# Altium project PCB_Project.PrjPcb
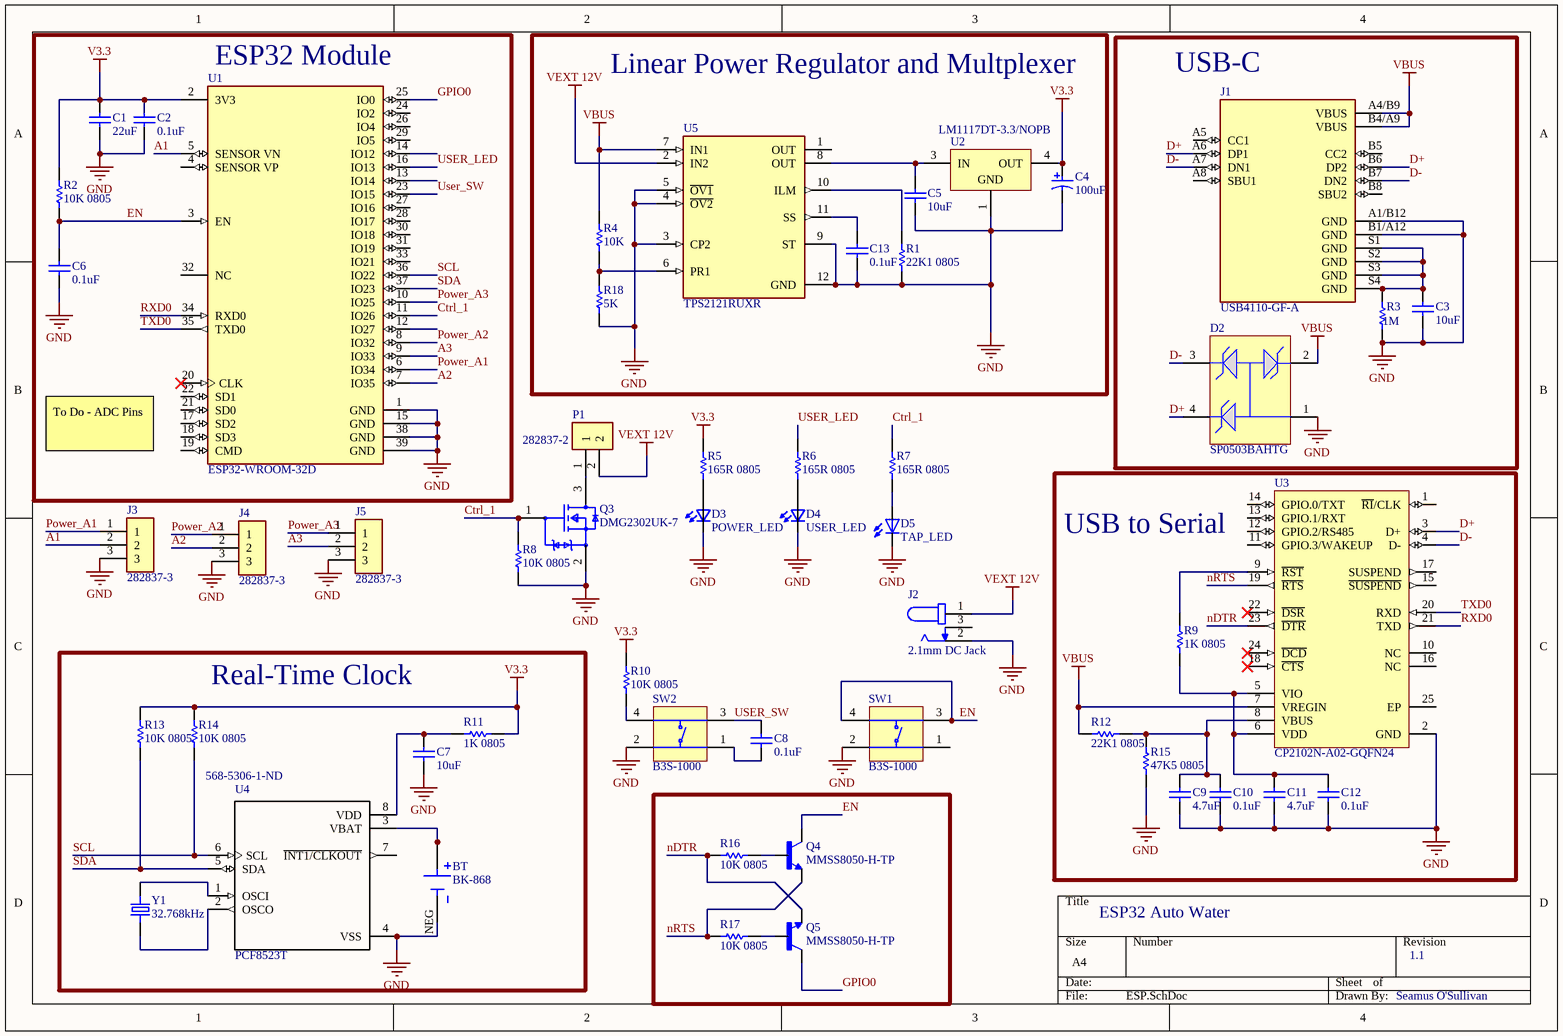
[diagram p0: ESP.SchDoc]
1 sheet, 53 parts. Net scope: global (net labels, ports and power ports of the same name join across sheets).
Board file: PCB.PcbDoc

## Sheet ESP.SchDoc: ESP32 Auto Water
size A4; DrawnBy: Seamus O'Sullivan; Revision: 1.1

### Parts
BT  BK-868  [BAT_BK-868]
C1  22uF  [CAPC1206(3216)190_N]
C2  0.1uF  [CAPC2013X135X45ML10T25]
C3  10uF  [CAPC2013X135X45ML10T25]
C4  100uF  [AVX-TAJD107K016RNJ-2_M]
C5  10uF  [CAPC2013X135X45ML10T25]
C6  0.1uF  [CAPC2013X135X45ML10T25]
C7  10uF  [CAPC2013X135X45ML10T25]
C8  0.1uF  [CAPC2013X135X45ML10T25]
C9  4.7uF  [CAPC2013X145X50ML20T25]
C10  0.1uF  [CAPC2013X135X45ML10T25]
C11  4.7uF  [CAPC2013X145X50ML20T25]
C12  0.1uF  [CAPC2013X135X45ML10T25]
C13  0.1uF  [CAPC2013X135X45ML10T25]
D2  SP0503BAHTG  [LFUS-SOT143-4_V]
D3  POWER_LED  [0603]
D4  USER_LED  [0603]
D5  TAP_LED  [DIOC200X125X110]
J1  USB4110-GF-A  [GCT_USB4110-GF-A]
J2  2.1mm DC Jack  [CUI_PJ-036AH-SMT-TR]
J3  282837-3  [TE_282837-3]
J4  282837-3  [TE_282837-3]
J5  282837-3  [TE_282837-3]
P1  282837-2  [TE_282837-2]
Q3  DMG2302UK-7  [FP-SOT23-MFG]
Q4  MMSS8050-H-TP  [TRANS_MMSS8050-H-TP]
Q5  MMSS8050-H-TP  [TRANS_MMSS8050-H-TP]
R1  22K1 0805  [RESC2013X50X30ML20T20]
R2  10K 0805  [RESC2013X50X30NL20T20]
R3  1M  [RESC0805(2012)_N]
R4  10K  [RESC2013X50X30NL20T20]
R5  165R 0805  [RESC2013X50X30ML20T20]
R6  165R 0805  [RESC2013X50X30ML20T20]
R7  165R 0805  [RESC2013X50X30ML20T20]
R8  10K 0805  [RESC2013X50X30NL20T20]
R9  1K 0805  [RESC2013X50X30ML20T20]
R10  10K 0805  [RESC2013X50X30NL20T20]
R11  1K 0805  [RESC2013X50X30ML20T20]
R12  22K1 0805  [RESC2013X50X30ML20T20]
R13  10K 0805  [RESC2013X50X30NL20T20]
R14  10K 0805  [RESC2013X50X30NL20T20]
R15  47K5 0805  [RESC2013X50X30LL20T20]
R16  10K 0805  [RESC2013X50X30NL20T20]
R17  10K 0805  [RESC2013X50X30NL20T20]
R18  5K  [RESC2013X50X30ML20T20]
SW1  B3S-1000  [OMRON-B3S-1000-4_V]
SW2  B3S-1000  [OMRON-B3S-1000-4_V]
U1  ESP32-WROOM-32D  [FP-ESP32-WROOM-32D-MFG]
U2  LM1117DT-3.3/NOPB  [NDP0003B_M]
U3  CP2102N-A02-GQFN24  [SLAB-QFN-24-2550x2550TP_A_V]
U4  PCF8523T  Supplier Part Number 1: 568-5306-1-ND  [*SOIC127P600X175-8N]
U5  TPS2121RUXR  [FP-RUX0012A-MFG]
Y1  32.768kHz  [XTAL_ECS-.327-12.5-34B-TR]

### Blocks framed on the sheet
ESP32 Module: C1 C2 C6 R2 U1
Linear Power Regulator and Multplexer: C4 C5 C13 R1 R4 R18 U2 U5
USB-C: C3 D2 J1 R3
USB to Serial: C9-C12 R9 R12 R15 U3
Real-Time Clock: BT C7 R11 R13 R14 U4 Y1

### Nets
GND: BT.NEG C1.1 C2.1 C3.1 C4.2 C5.1 C6.1 C7.1 C9.1 C10.1 C11.1 C12.1 C13.1 D2.1 D3.1(K2) D4.1(K2) D5.NEG J1.A1/B12(GND) J1.B1/A12(GND) J2.2 J3.3 J4.3 J5.3 Q3.2(S) R1.1 R3.1 R8.1 R15.1 R18.1 SW1.2 SW2.2 U1.1(GND) U1.15(GND) U1.38(GND) U1.39(GND) U2.1(GND) U3.2(GND) U4.4(VSS) U5.3(CP2) U5.4(~{OV2}) U5.5(~{OV1}) U5.9(ST) U5.12(GND)
V3.3: C1.2 C2.2 C4.1 R2.2 R5.2 R10.2 R11.1 R13.2 R14.2 U1.2(3V3) U2.4(OUT)
VBUS: D2.2 J1.A4/B9(VBUS) J1.B4/A9(VBUS) R4.2 R12.1 U3.7(VREGIN) U5.7(IN1)
VEXT 12V: J2.1 P1.2 U5.2(IN2)
A1: J3.2 U1.5(SENSOR_VN)
A2: J4.2 U1.7(IO35)
A3: J5.2 U1.9(IO33)
Ctrl_1: Q3.1(G) R7.2 R8.2 U1.11(IO26)
D+: D2.4 J1.A6(DP1) J1.B6(DP2) U3.3(D+)
D-: D2.3 J1.A7(DN1) J1.B7(DN2) U3.4(D-)
EN: C6.2 Q4.3(C) R2.1 SW1.3 SW1.4 U1.3(EN)
GPIO0: Q5.3(C) U1.25(IO0)
nDTR: Q5.2(E) R16.2 U3.23(~{DTR})
nRTS: Q4.2(E) R17.2 U3.19(~{RTS})
Power_A1: J3.1 U1.6(IO34)
Power_A2: J4.1 U1.8(IO32)
Power_A3: J5.1 U1.10(IO25)
RXD0: U1.34(RXD0) U3.21(TXD)
SCL: R14.1 U1.36(IO22) U4.6(SCL)
SDA: R13.1 U1.37(IO23) U4.5(SDA)
TXD0: U1.35(TXD0) U3.20(RXD)
USER_LED: R6.2 U1.16(IO13)
USER_SW: C8.2 SW2.3 U1.23(IO15)
NetBT_S1+: BT.S1+(POS) BT.S2+(POS) U4.3(VBAT)
NetC3_2: C3.2 J1.S1(GND) J1.S2(GND) J1.S3(GND) J1.S4(GND) R3.2
NetC5_2: C5.2 U2.3(IN) U5.8(OUT)
NetC7_2: C7.2 R11.2 U4.8(VDD)
NetC8_1: C8.1 SW2.1
NetC9_2: C9.2 C10.2 R12.2 R15.2 U3.8(VBUS)
NetC11_2: C11.2 C12.2 R9.1 U3.5(VIO) U3.6(VDD)
NetC13_2: C13.2 U5.11(SS)
NetD3_2: D3.2(A2) R5.1
NetD4_2: D4.2(A2) R6.1
NetD5_POS: D5.POS R7.1
NetP1_1: P1.1 Q3.3(D)
NetQ4_1: Q4.1(B) R16.1
NetQ5_1: Q5.1(B) R17.1
NetR1_2: R1.2 U5.10(ILM)
NetR4_1: R4.1 R18.2 U5.6(PR1)
NetR9_2: R9.2 U3.9(~{RST})
NetR10_1: R10.1 SW2.4
NetU4_1: U4.1(OSCI) Y1.2
NetU4_2: U4.2(OSCO) Y1.1

Not connected (* = marked no-connect by the designer): J1 A5(CC1) A8(SBU1) B5(CC2) B8(SBU2); J2 3; SW1 1; U1 4(SENSOR_VP) 12(IO27) 13(IO14) 14(IO12) 17(SD2) 18(SD3) 19(CMD) 20(CLK)* 21(SD0) 22(SD1) 24(IO2) 26(IO4) 27(IO16) 28(IO17) 29(IO5) 30(IO18) 31(IO19) 32(NC) 33(IO21); U3 1(~{RI}/CLK) 10(NC) 11(GPIO.3/WAKEUP) 12(GPIO.2/RS485) 13(GPIO.1/RXT) 14(GPIO.0/TXT) 15(~{SUSPEND}) 16(NC) 17(SUSPEND) 18(~{CTS})* 22(~{DSR})* 24(~{DCD})* 25(EP); U4 7(~{INT1/CLKOUT}); U5 1(OUT)

### Notes on the sheet
- To Do - ADC Pins
- Title
- Size:
- Date:
- A4
- Number:
- Time:
- Revision:
- Sheet
- of
- File:

### Library data of the parts
BT = BK-868: BATTERY RETAINER COIN 16MM SMD; MF: MPD; SnapEDA_Link: https://www.snapeda.com/parts/BK-868/Memory%20Protection%20Devices/view-part/4219637/?ref=snap; Value: *; Price: None; Availability: Unavailable; MP: BK-868; DigiKey-Purchase-URL: https://snapeda.com/shop?store=DigiKey&id=4219637; Package: None
C1 = CMP-1037-04992-1: CAP 22uF 16V ±10% 1206 (3216 Metric) Thickness 1.9mm SMD; Case-EIA: 1206; Case-Metric: 3216; Tolerance: Â±10%; Rated Voltage: 16 V; Technology: SMT; Value: 22uF; Max Thickness: 1.9 mm
C2 C6 C8 C10 C12 C13 = CMP-2100-03644-1: Chip Capacitor, 0.1 uF, +/- 10%, 50 V, -55 to 125 degC, 0805 (2012 Metric), RoHS, Tape and Reel; Manufacturer: Murata; Voltage: 50V; Capacitance: 100nF; Insulation Resistance: 10GR; Dielectric Material: Ceramic; Dielectric: X7R; Package Description: 2-Pin Surface Mount Device, Body 2 x 1.25 mm; Manufacturer URL: http://www.murata.com/; Case Code (Imperial): 0805; Datasheet URL: http://psearch.en.murata.com/capacitor/product/GRM21BR71H104KA01%23.pdf; Termination: SMD/SMT; Lead Free: LeadFree; Package Quantity: 1; Mount: SurfaceMount; REACH SVHC: Unknown; Thickness: 0.053inch; Height: 1.25mm; Case/Package: 0805; Voltage Rating: 50V; Width: 0.049inch; Case Code (Metric): 2012; Material: Ceramic; Min Operating Temperature: -55degC; RoHSCompliant: true; Datasheet Version: 42675.0; Voltage Rating (DC): 50V; Tolerance: 10%; Package Reference: 0805; Depth: 1.25mm; Length: 2mm; Max Operating Temperature: 125degC; Packaging: TapeandReel; Number of Pins: 2; Radiation Hardening: No
C3 C5 C7 = CMP-2007-03541-1: Part Number: GRM21BR61E106KA73L; Manufacturer: Murata
C4 = CMP-2000-05064-1: Cap Tant Solid, 100 uF, +/- 10%, 16 V, -55 to 125 degC, 2-Pin SMD (2917), RoHS, Tape and Reel; Manufacturer: AVX; Product Diameter (mm): NotRequiredmm; Case Style: Molded; Product Length (mm): 7.3mm; DCL: 16uA; Capacitance: 100000000pF; Polarity: Polar; Rad Hardened: No; Insulation: NotRequired; ESR: 0.6ohm; DF: 6%; Product Height (mm): 2.9mm; Product Depth (mm): 4.3mm; Voltage: 16VDC; Case Code: D; Operating Temp Range: -55Cto125C; Packaging: TapeandReel; Length W/Weld (max): NotRequiredmm; Datasheet URL: https://datasheet.ciiva.com/26341/559463-da-01-en-tacc-d-7-3-mm-x-4-3-mm-x-2-9-mm-100-uf-26341798.pdf; Length W/Weld: NotRequiredmm; Construction: SMTChip; Wire Form: NotRequired; Tolerance (+ or -): 10%; Manufacturer URL: http://www.avx.com/; Seated Plane Height: NotRequiredmm; Datasheet Version: Apr-13; Lead Spacing (nom): NotRequiredmm; Failure Rate: NotRequired; Seal: NotRequired; Mounting Style: SurfaceMount; Package / Case: 7343-31
C9 C11 = CMP-2007-01010-1: 0805 Tant; Manufacturer: Kemet; Part Number: C0805C475K3PACTU
  C9: ComponentLink1Description: New link; ComponentLink1URL: *
D2 = CMP-2000-05191-1: TVS Diode Array, 30 pF, 30 KV, -40 to 85 degC, 4-Pin SOT143, RoHS, Tape and Reel; Manufacturer: Littelfuse; Direction Type: Uni-Directional; Product Height (mm): 1.05mm; Leakage Current (Max): 0.1uA; Clamping Voltage (Max): 8V; Reverse Stand-off Voltage: 5.5(Min)V; Configuration: Triple; Working Voltage: 5.5V; Product Length (mm): 3.04mm; Working Voltage (Max): 5.5V(Min); Capacitance Value: 30pF; Rad Hardened: No; Number of Elements: 3; Product Depth (mm): 1.4mm; Operating Temperature Max Deg. C: 85C; Suppressor Type: TVS; Operating Temperature Min Deg. C: -40C; Operating Temp Range: -40Cto85C; Mounting: SurfaceMount; Package / Case: SOT-143; Datasheet Version: Dec-13; Package Type: SOT-143; Packaging: TapeandReel; Pin Count: 3+Tab; Operating Temperature Classification: Industrial; Datasheet URL: https://datasheet.ciiva.com/15143/getdatasheetpartid-116020-15143550.pdf; Manufacturer URL: http://www.littelfuse.com/; Leakage Current: 0.1uA; Mounting Style: SurfaceMount; Clamping Voltage: 8V; Polarity: Uni-Directional
D3 = LTST-C191KSKT: Yellow 591nm LED Indication - Discrete 2.1V 0603 _1608 Metric_; MF: Lite-On Inc.; Digi-Key_Part_Number: 160-1448-1-ND; Package: 0603 Lite-On; SnapEDA_Link: https://www.snapeda.com/parts/LTST-C191KSKT/Lite-On%20Inc./view-part/265076/?ref=snap; MP: LTST-C191KSKT; Digi-Key_Purchase_URL: https://www.digikey.com/product-detail/en/lite-on-inc/LTST-C191KSKT/160-1448-1-ND/386838?utm_source=snapeda&utm_medium=aggregator&utm_campaign=symbol; Value: *
D4 = LTST-C191KRKT: Red 631nm LED Indication - Discrete 2V 0603 _1608 Metric_; MF: Lite-On Inc.; Value: *; Package: 0603 Lite-On; Digi-Key_Purchase_URL: https://www.digikey.in/product-detail/en/lite-on-inc/LTST-C191KRKT/160-1447-1-ND/386836?utm_source=snapeda&utm_medium=aggregator&utm_campaign=symbol; SnapEDA_Link: https://www.snapeda.com/parts/LTST-C191KRKT/Lite-On%20Inc./view-part/234319/?ref=snap; Digi-Key_Part_Number: 160-1447-1-ND; MP: LTST-C191KRKT
D5 = LTST-C171TBKT: Blue 470nm LED Indication - Discrete 3.3V 0805 _2012 Metric_; MF: Lite-On Inc.; SnapEDA_Link: https://www.snapeda.com/parts/LTST-C171TBKT/Lite-On%20Inc./view-part/400349/?ref=snap; Availability: Unavailable; Price: None; Package: 0805 Lite-On; Value: *; MP: LTST-C171TBKT
J1 = USB4110-GF-A: USB-C _USB TYPE-C_ USB 2.0 Receptacle Connector 24 _16+8 Dummy_ Position Surface Mount, Right Angle; Through Hole; MF: GCT; Digi-Key_Purchase_URL: https://www.digikey.com/product-detail/en/gct/USB4110-GF-A/2073-USB4110-GF-A-1-ND/10384548?utm_source=snapeda&utm_medium=aggregator&utm_campaign=symbol; Value: *; Package: None; MP: USB4110-GF-A; SnapEDA_Link: https://www.snapeda.com/parts/USB4110-GF-A/Global%20Connector%20Technology/view-part/4001167/?ref=snap; Digi-Key_Part_Number: 2073-USB4110-GF-A-1-ND
J2 = PJ-036AH-SMT-TR: 2.0 x 6.3 mm, 5.0 A, Horizontal, Surface Mount _SMT_, Dc Power Jack Connector; MF: CUI Devices; Value: *; SnapEDA_Link: https://www.snapeda.com/parts/PJ-036AH-SMT-TR/CUI%20Devices/view-part/517505/?ref=snap; Package: None; CUI_purchase_URL: https://www.cuidevices.com/product/interconnect/connectors/dc-power-connectors/jacks/pj-036ah-smt-tr?utm_source=snapeda.com&utm_medium=referral&utm_campaign=snapedaBOM; MP: PJ-036AH-SMT-TR; Price: None; Availability: Unavailable
J3-J5 = 282837-3: Wire to Board 3 Position 5.08 mm Pitch 30-16 AWG Euro Style Terminal Block; MF: TE Connectivity; Package: None; Digi-Key_Part_Number: A113321-ND; MP: 282837-3; TE_purchase_URL: https://www.te.com/usa-en/product-282837-3.html?te_bu=Cor&te_type=disp&te_campaign=seda_glo_cor-seda-global-disp-prtnr-fy19-seda-model-bom-cta_sma-317_1&elqCampaignId=32493; SnapEDA_Link: https://www.snapeda.com/parts/282837-3/TE%20Connectivity%20AMP%20Connectors/view-part/2765182/?ref=snap; Digi-Key_Purchase_URL: https://www.digikey.in/product-detail/en/te-connectivity-amp-connectors/282837-3/A113321-ND/2187974?utm_source=snapeda&utm_medium=aggregator&utm_campaign=symbol; Value: *; Supplier 1: Digi-Key; Supplier Part Number 1: A113321-ND
P1 = 282837-2: Connector Terminal Blocks Receptacle 2 Position 5.08mm Solder Straight Thru-Hole 13.5A/Contact; MF: TE Connectivity; Digi-Key_Purchase_URL: https://www.digikey.in/product-detail/en/te-connectivity-amp-connectors/282837-2/A113320-ND/2187973?utm_source=snapeda&utm_medium=aggregator&utm_campaign=symbol; Value: *; TE_purchase_URL: https://www.te.com/usa-en/product-282837-2.html?te_bu=Cor&te_type=disp&te_campaign=seda_glo_cor-seda-global-disp-prtnr-fy19-seda-model-bom-cta_sma-317_1&elqCampaignId=32493; Package: None; MP: 282837-2; SnapEDA_Link: https://www.snapeda.com/parts/282837-2/TE%20Connectivity%20AMP%20Connectors/view-part/2549980/?ref=snap; Digi-Key_Part_Number: A113320-ND; Supplier 1: Digi-Key; Supplier Part Number 1: A113320-ND
Q3 = CMP-12801-000001-1: MOSFET N-CH 20V 2.8A SOT23; Manufacturer: Diodes Inc.; Reverse Recovery Time: 5.3ns; Gate Charge At Vgs: 2.8nC @ 10V; Turn On Delay Time: 0.6ns; Pulse Drain Current: 12A; Max Forward Diode Voltage: 1.2V; Reverse Recovery Charge: 0.5nC; Automotive Grade: Grade 0; Threshold Vgs Min: 0.3V; Number Of N Channels: 1; Standoff Height: 0.013mm; Typ Forward Diode Voltage: 0.7V; Drain To Source Resistance: 61mΩ; Rthja Max: 192°C/W; Max Junction Temp: +150°C; Input Capacitace At Vds: 130pF @ 10V; Threshold Vgs Max: 1V; Turn Off Delay Time: 4.2ns; Depletion Mode: False; Gate To Source Voltage: 12V; Power Dissipation: 0.66W; Device Class L1: Discrete Semiconductors; Footprint Url: https://www.diodes.com/assets/Package-Files/SOT23.pdf; Lead Free: Yes; Manufacturer Part Number: DMG2302UK-7; Temperature Range High: +150°C; Drain To Source Voltage: 20V; Category: Trans; Digikey Description: MOSFET N-CH 20V 2.8A SOT23; RoHS: TRUE; Device Class L2: Transistors; Height: 1.1mm; Automotive: Yes; Package: SOT23; Drain To Source Breakdown Voltage: 20V; Continuous Drain Current: 2.8A; ComponentLink2Description: Datasheet; Device Class L3: MOSFETs; Octopart: https://octopart.com/dmg2302uk-7-diodes+inc.-73850182; Temperature Range Low: -55°C; Temperature: -55°C to +150°C; Number Of Channels: 1; ComponentLink2URL: https://www.diodes.com/assets/Datasheets/DMG2302UK.pdf
Q4 Q5 = MMSS8050-H-TP: Bipolar _BJT_ Transistor NPN 25V 1.5A 100MHz 625mW Surface Mount SOT-23; MF: Micro Commercial; Value: *; Availability: Unavailable; SnapEDA_Link: https://www.snapeda.com/parts/MMSS8050-H-TP/Micro%20Commercial/view-part/423878/?ref=snap; Package: SOT-23 Micro Commercial; MP: MMSS8050-H-TP; Price: None
R1 R12 = CMP-2001-03689-1: Manufacturer: Vishay Dale; Part Number: CRCW080522K1FKEA
R2 R4 R8 R10 R13 R14 R16 R17 = CMP-2001-04909-1: Manufacturer: Vishay Dale; Part Number: CRCW080510K0FKEB
R3 = CMP-1013-00849-1: 1M 0.125W 1% 0805 (2012 Metric)  SMD; Value: 1000000.00 Ohm; Case-Metric: 2012; Case-EIA: 0805; Technology: SMT; Power: 0.125 W; Tolerance: 1 %
R5-R7 = CMP-2001-04978-1: Part Number: CRCW0805165RFKEA; Manufacturer: Vishay Dale
R9 R11 = CMP-2001-03596-1: Part Number: CRCW08051K00FKEB; Manufacturer: Vishay Dale
R15 = CMP-2001-03941-1: Part Number: CRCW080547K5FKEA; Manufacturer: Vishay Dale
R18 = CMP-2001-04239-1: Part Number: CRCW08055K00FKTA; Manufacturer: Vishay Dale
SW1 SW2 = CMP-1677-00001-4: Sealed Tactile Switch, SPST-NO, 3 to 24 V, -25 to 70 degC, 4-Pin SMD, RoHS, Bulk; Manufacturer: Omron; Voltage Rating: 24 V; Current Rating: 50 mA; Contact Plating: Silver; ComponentLink1Description: Manufacturer URL; Packaging: Bulk; Package Quantity: 1500; Min Operating Temperature: -25 degC; Max Operating Temperature: 70 degC; REACH SVHC: No SVHC; ComponentLink1URL: http://www.omron.com/; RoHSCompliant: true; PackageDescription: 4-Pin Surface Mount Device, Body 6.6 x 6 mm; ComponentLink2URL: http://www.omron.com/ecb/products/pdf/en-b3s.pdf; DatasheetVersion: 10/2014; Length: 6.6 mm; Height: 4.3 mm; ComponentLink2Description: Datasheet; Mount: Surface Mount; Mounting Technology: Surface Mount; PackageReference: B3S-1000
U1 = CMP-194065-000003-1: WIFI MODULE 32MBITS SPI FLASH; Manufacturer: Espressif Systems; Max Supply Voltage: 3.6V; Nominal Supply Current: 500mA; Max Frequency: 2484MHz; Number Of Adc Channels: 16; Number Of Gpio: 32; Interface: I2C,SPI,UART,Ethernet,I2S,Other; Data Rate: 150Mbits/s; Min Supply Voltage: 3V; Bandwidth: 72MHz; Sensitivity: -98dBm; Octopart: https://octopart.com/esp32-wroom-32d-espressif+systems-91040050; Package: ESP32-WROOM-32D; ComponentLink2URL: https://www.espressif.com/sites/default/files/documentation/esp32-wroom-32d_esp32-wroom-32u_datasheet_en.pdf; Lead Free: Yes; Category: UNK; Mouser Description: Wi-Fi/BT BLE Module ESP32-D0WD, SPI Flash, UART, P; Device Class L1: Integrated Circuits (ICs); RoHS: TRUE; Temperature Range Low: -40°C; ComponentLink2Description: Datasheet; Digikey Description: WIFI MODULE 32MBITS SPI FLASH; Height: 3.2mm; Temperature: -40°C to +85°C; Manufacturer Part Number: ESP32-WROOM-32D; Device Class L3: Transceivers; Device Class L2: RF Semiconductors and Devices; Temperature Range High: +85°C; Automotive: No
U2 = CMP-0062-00703-3: 800mA Low-Dropout Linear Regulator, 3-pin TO-252, Pb-Free; Manufacturer: Texas Instruments; PowerWise: N; PackageTopMarking: NSUZXYTT*LM1117*DT-3.3; CompType: LDO IC; RoHS: Y; PackageReference: NDP0003B; PackageDescription: TO252, Molded, Jedec, 6.8 x 6.10 x 2.30mm Body, 3 Lead, 2.28mm Pitch, Surface Mount; Code_JEDEC: TO-252-AA; PinCount: 3; ComponentLink1URL: http://www.ti.com/general/docs/lit/getliterature.tsp?genericPartNumber=LM1117-N&fileType=pdf; ComponentLink1Description: Datasheet URL; Parameter 1: *
U3 = CMP-2000-07570-1: USBXpress(TM) Family, 4 GPIOs, 2.2 to 3.6 V, -40 to 85 degC, 24-Pin QFN, RoHS; Manufacturer: Silicon Labs; Max Supply Voltage: 3.6V; Min Supply Voltage: 3V; Datasheet Version: Rev. 1.1, 08/2016; Max Operating Temperature: 85degC; Case\/Package: QFN; Number of Pins: 24; Min Operating Temperature: -40degC; Mounting Technology: SurfaceMount; Manufacturer URL: http://www.silabs.com/; RoHSCompliant: False; Package Reference: QFN-24-2550x2550TP_A; Datasheet URL: http://www.silabs.com/documents/public/data-sheets/cp2102n-datasheet.pdf; Package Description: 24-Pin Quad Flat No-lead Package, Body 4 x 4 mm, Pitch 0.5 mm; REACH SVHC: Unknown
U4 = PCF8523T: Real Time Clock _RTC_ IC Clock/Calendar IÂ²C, 2-Wire Serial 8-SOIC _0.154, 3.90mm Width_; MF: NXP USA; Digi-Key_Purchase_URL: https://www.digikey.com/product-detail/en/nxp-usa-inc/PCF8523T-1,118/568-5306-1-ND/2530784?utm_source=snapeda&utm_medium=aggregator&utm_campaign=symbol; MP: PCF8523T; Package: VDFN-8 NXP USA; SnapEDA_Link: https://www.snapeda.com/parts/PCF8523T/NXP%20USA%20Inc./view-part/3227764/?ref=snap; Digi-Key_Part_Number: 568-5306-1-ND; Value: *; Supplier 1: Digi-Key
U5 = CMP-04910-000009-1: PWR MGMT BATTERY MGMT; Manufacturer: Texas Instruments; Min Supply Voltage: 2.8V; Max Junction Temp: +125°C; Output Voltage: 22V; Output Current: 1.5-5.2A; Standoff Height: 0mm; Number Of Outputs: 1; Nominal Supply Current: 300uA; Device Class L2: Power Management ICs; Octopart: https://octopart.com/tps2121ruxr-texas+instruments-95511053; Mouser Description: 2.7-22V, 56m?, 4.5A, Priority Power MUX with Seamless Switchover 12-VQFN-HR -40 to 125; Lead Free: Yes; Digikey Description: PWR MGMT BATTERY MGMT; Manufacturer Part Number: TPS2121RUXR; Height: 1mm; Device Class L1: Integrated Circuits (ICs); Category: IC; Max Supply Voltage: 22V; ComponentLink2Description: Datasheet; Temperature: -40°C to +125°C; Temperature Range High: +125°C; ComponentLink2URL: https://www.ti.com/lit/ds/symlink/tps2121.pdf; Automotive: No; Package: RUX0012A; RoHS: TRUE; Device Class L3: unset; Temperature Range Low: -40°C
Y1 = ECS-.327-12.5-34B-TR: 32.768kHz Â±20ppm Crystal 12.5pF 70 kOhms 2-SMD, No Lead; MF: ECS Inc.; SnapEDA_Link: https://www.snapeda.com/parts/ECS-.327-12.5-34B-TR/ECS%20Inc./view-part/55052/?ref=snap; Availability: Unavailable; MP: ECS-.327-12.5-34B-TR; Value: *; Price: None; Package: SMD-2 ECS International